# EAGLE design myPlant (EAGLE 8.2.2)
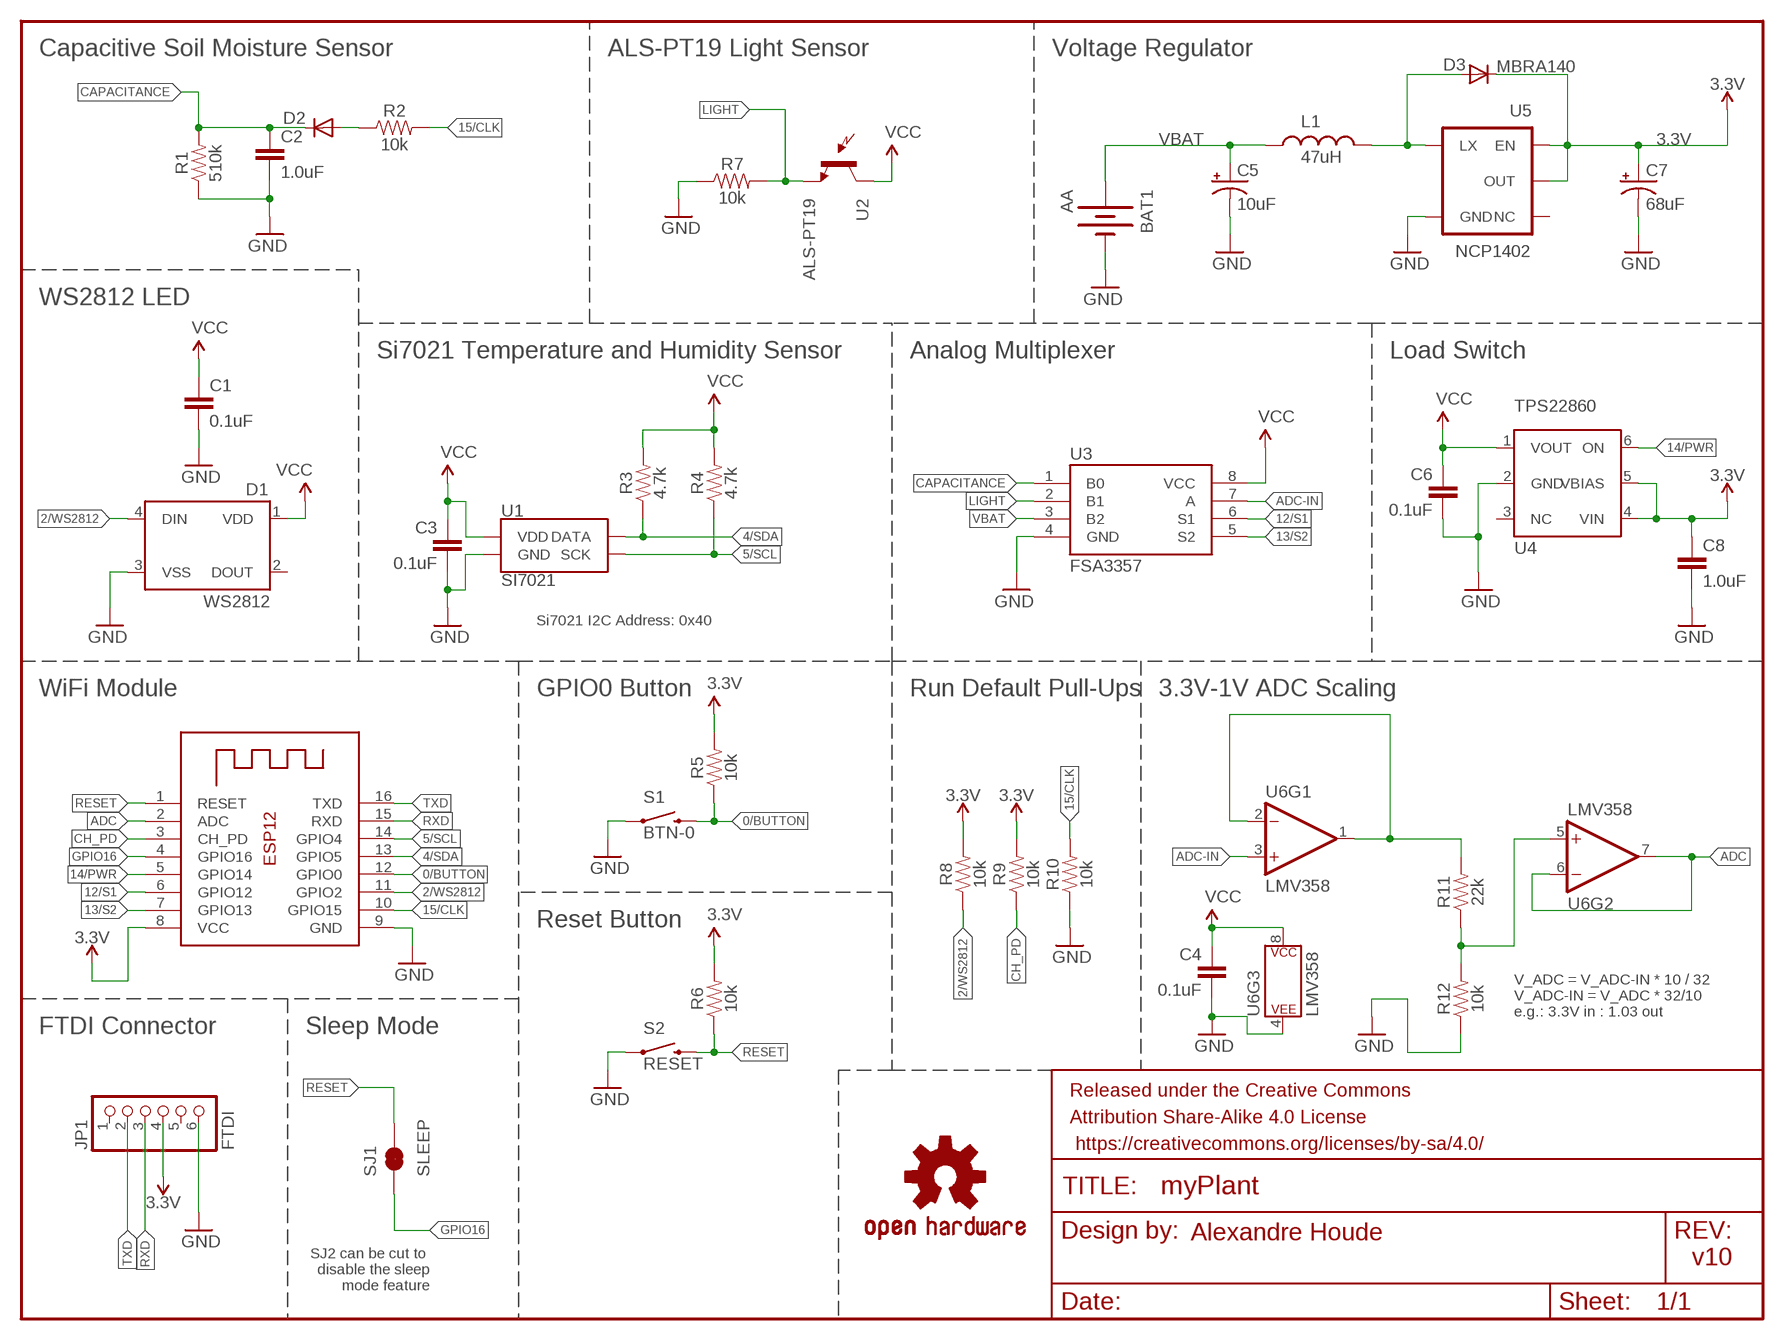
[diagram p0: schematic, sheet 1]

## Parts
BAT1  AA  BATTERYAA-KIT  [BATTERY-AA-KIT]
C1  0.1uF  0.1UF-0603-25V-(+80/-20%)  [0603]
C2  1.0uF  1.0UF-0603-16V-10%  [0603]
C3  0.1uF  0.1UF-0603-25V-(+80/-20%)  [0603]
C4  0.1uF  0.1UF-0603-25V-(+80/-20%)  [0603]
C5  10uF  CAP_POL1206  [EIA3216]
C6  0.1uF  0.1UF-0603-25V-(+80/-20%)  [0603]
C7  68uF  CAP_POL3528  [EIA3528]
C8  1.0uF  1.0UF-0603-16V-10%  [0603]
D1  WS2812  WS2812B  [WS2812B]
D2  DIODE-SCHOTTKY_  DIODESOD-523  [SOD-523]
D3  MBRA140  DIODESMA  [SMA-DIODE]
FRAME1  FRAME-LETTER  [CREATIVE_COMMONS]
JP1  FTDI  HEADER-1X670MIL  [1X06_ROUND_70]
L1  47uH  INDUCTORCR54  [CR54]
LOGO2  OSHW-LOGOS  [OSHW-LOGO-S]
R1  510k  10KOHM-0603-1/10W-1%  [0603]
R2  10k  10KOHM-0603-1/10W-1%  [0603]
R3  4.7k  4.7KOHM-0603-1/10W-1%  [0603]
R4  4.7k  4.7KOHM-0603-1/10W-1%  [0603]
R5  10k  10KOHM-0603-1/10W-1%  [0603]
R6  10k  10KOHM-0603-1/10W-1%  [0603]
R7  10k  10KOHM-0603-1/10W-1%  [0603]
R8  10k  10KOHM-0603-1/10W-1%  [0603]
R9  10k  10KOHM-0603-1/10W-1%  [0603]
R10  10k  10KOHM-0603-1/10W-1%  [0603]
R11  22k  22KOHM-0603-1/10W-1%  [0603]
R12  10k  10KOHM-0603-1/10W-1%  [0603]
S1  BTN-0  SWITCH-MOMENTARY-2SMD-4.6X2.8MM  [TACTILE_SWITCH_SMD_4.6X2.8MM]
S2  RESET  SWITCH-MOMENTARY-2SMD-4.6X2.8MM  [TACTILE_SWITCH_SMD_4.6X2.8MM]
SJ1  SLEEP  JUMPER-PAD-2-NC_BY_TRACE  [PAD-JUMPER-2-NC_BY_TRACE_YES_SILK]
U1  SI7021  [DFN-6-3X3-SI7021]
U2  ALS-PT19  LIGHTSENSORALS  [ALS-PT19]
U3  FSA3357  [US8]
U4  TPS22860  [SOT23-6]
U5  NCP1402  V_REG_NCP1400SOT23-5  [SOT23-5]
U6  LMV358  [MSOP8]
X1  ESP-12  [ESP-12]

## Nets
0/BUTTON: R5.1 S1.3 S1.4 X1.12(GPIO0)
2/WS2812: D1.4(DIN) R8.1 X1.11(GPIO2)
3.3V: C7.A(+) C8.1 D3.C JP1.4 R5.2 R6.2 R8.2 R9.2 U4.4(VIN) U4.5(VBIAS) U5.1(EN) U5.2(OUT) X1.8(VCC)
4/SDA: R3.1 U1.DATA X1.13(GPIO5)
5/SCL: R4.1 U1.SCK X1.14(GPIO4)
12/S1: U3.6(S1) X1.6(GPIO12)
13/S2: U3.5(S2) X1.7(GPIO13)
14/PWR: U4.6(ON) X1.5(GPIO14)
15/CLK: R2.2 R10.2 X1.10(GPIO15)
ADC: U6.6(-IN) U6.7(OUT) X1.2(ADC)
ADC-IN: U3.7(A) U6.3(+IN)
CAPACITANCE: C2.1 D2.K(C) R1.2 U3.1(B0)
CH_PD: R9.1 X1.3(CH_PD)
GND: BAT1.GND@1(-) C1.2 C2.2 C3.2 C4.2 C5.C(-) C6.2 C7.C(-) C8.2 D1.3(VSS) JP1.6 R1.1 R7.1 R10.1 R12.1 S1.1 S1.2 S2.1 S2.2 U1.GND U3.4(GND) U4.2(GND) U5.4(GND) U6.4(P$V-) X1.9(GND)
GPIO16: SJ1.1 X1.4(GPIO16)
LIGHT: R7.2 U2.E(E1) U3.2(B1)
N$3: D3.A L1.P$2 U5.5(LX)
N$15: R11.2 U6.1(OUT) U6.2(-IN)
N$18: R11.1 R12.2 U6.5(+IN)
RESET: R6.1 S2.3 S2.4 SJ1.2 X1.1(RESET)
RXD: JP1.3 X1.15(RXD)
TXD: JP1.2 X1.16(TXD)
V_CAP: D2.A R2.1
VBAT: BAT1.PWR@1(+) C5.A(+) L1.P$1 U3.3(B2)
VCC: C1.1 C3.1 C4.1 C6.1 D1.1(VDD) R3.2 R4.2 U1.VDD U2.C(C1) U3.8(VCC) U4.1(VOUT) U6.8(P$V+)
Unconnected: D1.2(DOUT) JP1.1 JP1.5 U4.3(NC) U5.3(NC)

## Notes on the sheet
- Capacitive Soil Moisture Sensor | ALS-PT19 Light Sensor | Voltage Regulator
- WS2812 LED
- Si7021 Temperature and Humidity Sensor | Analog Multiplexer | Load Switch
- Si7021 I2C Address: 0x40
- WiFi Module | GPIO0 Button | Run Default Pull-Ups | 3.3V-1V ADC Scaling
- Reset Button
- V_ADC = V_ADC-IN * 10 / 32
  V_ADC-IN = V_ADC * 32/10
  e.g.: 3.3V in : 1.03 out
- FTDI Connector | Sleep Mode
- Alexandre Houde
- SJ2 can be cut to 
  disable the sleep
  mode feature
- v10

## Library data of the parts
BAT1 = SparkFun:BATTERY: Battery Holders Various common sizes : AA, AAA, 20mm coin cell and 12mm coin cell.
C1 C3 C4 C6 = SparkFun-Capacitors:0.1UF: 0.1µF ceramic capacitors A capacitor is a passive two-terminal electrical component used to store electrical energy temporarily in an electric field.; PROD_ID: CAP-00810
C2 C8 = SparkFun-Capacitors:1.0UF: 1µF ceramic capacitors A capacitor is a passive two-terminal electrical component used to store electrical energy temporarily in an electric field.; PROD_ID: CAP-00868
C5 C7 = SparkFun:CAP_POL: Capacitor Polarized These are standard SMD and PTH capacitors. Normally 10uF, 47uF, and 100uF in electrolytic and tantalum varieties. Always verify the external diameter of the through hole cap, it varies with capacity, voltage, and manufacturer. The EIA devices should be standard.
D1 = SparkFun-LED:WS2812B: WS2812B - Intelligent control LED integrated light source Technical Specifications: Power Supply Voltage (VDD): 3.5 to 5.3 V Input Voltage (VI): -0.5 to VDD+0.5 V Operating Junction Temperature (Topt): -25°C to +80°C Storage Temperature Range (Tstg): -55°C to +150°C; PROD_ID: DIO-12503
D2 = microbuilder:DIODE: Diode
D3 = SparkFun:DIODE: Diode
FRAME1 = SparkFun-Aesthetics:FRAME-LETTER: Schematic Frame - Letter Standard 8.5x11 US Letter frame
JP1 = microbuilder:HEADER-1X6: PIN HEADER
L1 = SparkFun:INDUCTOR: Inductors Basic Inductor/Choke - 0603 and 1206. Footprints are not proven and vary greatly between part numbers.
LOGO2 = SparkFun-Aesthetics:OSHW-LOGO: Open Source Hardware Logo This logo indicates the piece of hardware it is found on incorporates a OSHW license and/or adheres to the definition of open source hardware found here: http://freedomdefined.org/OSHW
R1 = SparkFun-Resistors:10KOHM: 10kΩ resistor A resistor is a passive two-terminal electrical component that implements electrical resistance as a circuit element. Resistors act to reduce current flow, and, at the same time, act to lower voltage levels within circuits. - Wikipedia; PROD_ID: RES-00824; VALUE: 10k
R2 R5-R10 R12 = SparkFun-Resistors:10KOHM: 10kΩ resistor A resistor is a passive two-terminal electrical component that implements electrical resistance as a circuit element. Resistors act to reduce current flow, and, at the same time, act to lower voltage levels within circuits. - Wikipedia; PROD_ID: RES-00824
R3 R4 = SparkFun-Resistors:4.7KOHM: 4.7kΩ resistor A resistor is a passive two-terminal electrical component that implements electrical resistance as a circuit element. Resistors act to reduce current flow, and, at the same time, act to lower voltage levels within circuits. - Wikipedia; PROD_ID: RES-07857
R11 = SparkFun-Resistors:22KOHM: 22kΩ resistor A resistor is a passive two-terminal electrical component that implements electrical resistance as a circuit element. Resistors act to reduce current flow, and, at the same time, act to lower voltage levels within circuits. - Wikipedia; PROD_ID: RES-07853
S1 S2 = SparkFun-Electromechanical:SWITCH-MOMENTARY-2: Various NO switches- pushbuttons, reed, etc; PROD_ID: SWCH-13065
SJ1 = SparkFun-Passives:JUMPER-PAD-2-NC_BY_TRACE
U1 = SparkFun-Sensors:SI7021: Silicon Labs Si7021 I2C Humidity and Temperature Sensor The Si7021 is a low-cost, easy-to-use, highly accurate, digital humidity and temperature sensor. This sensor is ideal for environmental sensing and data logging and perfect for build a weather stations or humidor control system. All you need are two lines for I2C communication, and you’ll have relative humidity readings and very accurate temperature readings as a bonus! Datasheet <https://cdn.sparkfun.com/datasheets/Sensors/Weather/Si7021.pdf> SparkFun Products SparkFun Humidity and Temperature Sensor Breakout - Si7021 <https://www.sparkfun.com/products/13763> (SEN-13763) SparkFun Blynk Board - ESP8266 <https://www.sparkfun.com/products/13794> (WRL-13794); PROD_ID: IC-13093
U2 = SparkFun-Sensors:LIGHTSENSOR: Ambient Light Sensor Simple light detection sensor. Output varies with light intensity input. Spark Fun Electronics SKU : COM-08348; PROD_ID: IC-11836
U3 = alex:FSA3357
U4 = alex:TPS22860
U5 = SparkFun:V_REG_NCP1400: Switching step-up voltage regulator NCP1400 switiching regulator takes single cell AA and outputs 100mA at 3.3V or 5V with minimal number of external components.
U6 = SparkFun-IC-Amplifiers:LMV358: IC LMV358 DUAL OP AMP Jellybean rail-to-rail output op-amp SparkFun Products SparkFun PicoBoard <https://www.sparkfun.com/products/11888> (WIG-11888) SparkFun Vernier Interface Shield <https://www.sparkfun.com/products/12858> (DEV-12858) SparkFun Blynk Board - ESP8266 <https://www.sparkfun.com/products/13794> (WRL-13794) SparkFun Digital Sandbox <https://www.sparkfun.com/products/12651> (DEV-12651 RoHS)
X1 = microbuilder:ESP-12

## Net classes
1 vcc: width 0.203 mm

## Board
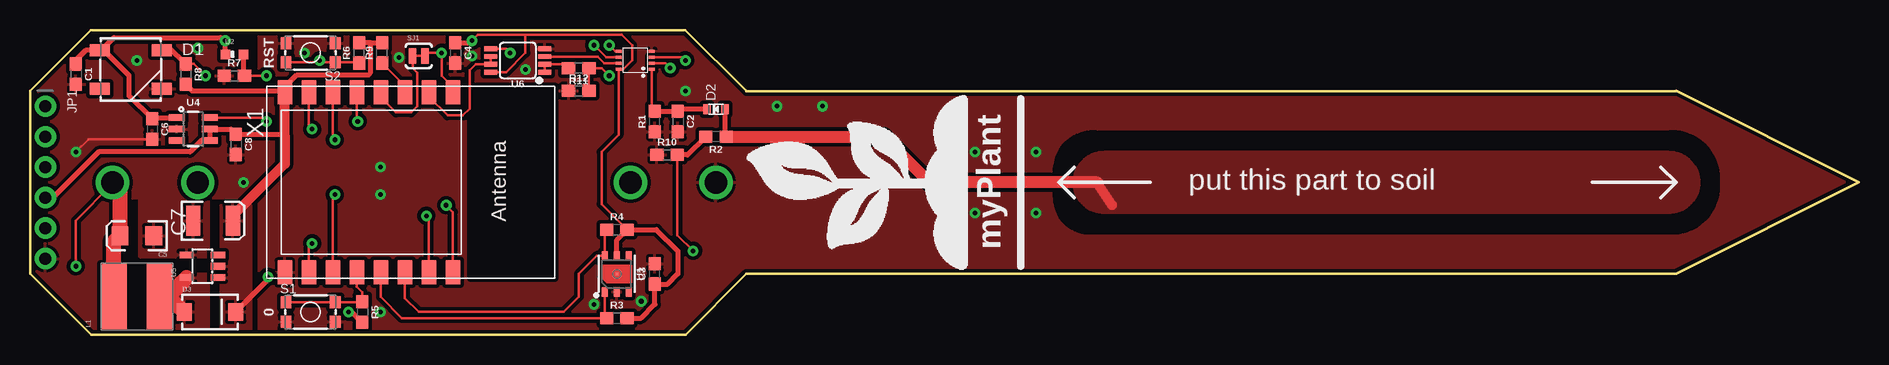
[diagram p1: board, top side]
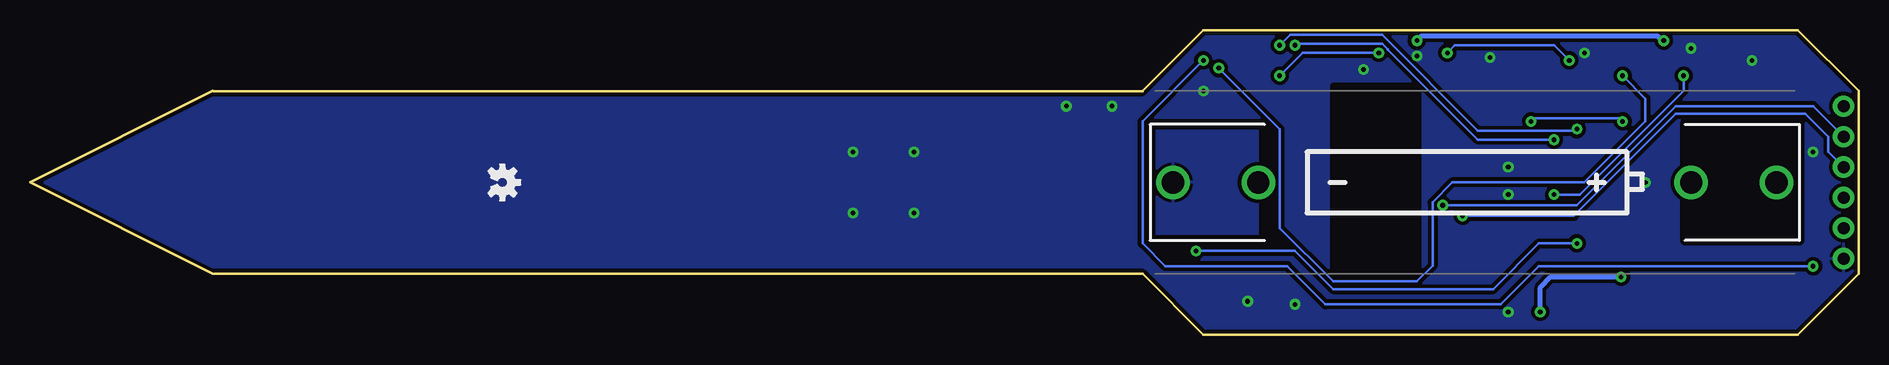
[diagram p2: board, bottom side, seen from below]

Size 152.41 x 25.4 mm. Coordinates in mm from the lower left corner, seen from the top.
Outline: 137.17,20.31 59.7,20.31
Outline: 5.1,25.4 54.62,25.4 59.7,20.33
Outline: 5.1,0 54.63,0 59.7,5.08 137.17,5.08 152.4,12.7
Outline: 152.41,12.71 137.17,20.32
Outline: 5.09,0.01 0.01,5.08 0,20.32
Outline: 5.08,25.4 0.01,20.32
Copper layers (1*16): Top 0.035mm / dielectric 1.5mm / Bottom 0.035mm
Design rules "SparkFun *": minimum track width 8mil, minimum drill 10mil, track to track 8mil, track to pad 8mil, pad to pad 8mil, via to via 8mil, smd to smd 8mil, copper to edge 8mil, drill to drill 8mil, minimum pad ring 12mil, minimum via ring 10mil, stop-mask expansion 4mil, vias tented up to drill 20mil, thermal gap 10mil

### Footprints (pad centres in the part's own frame; a part is rotated, then mirrored left to right if it is on the bottom)
BATTERY-AA-KIT = drill 1.854: GND@1 25.146,0; GND@2 18.034,0; PWR@1 -25.146,0; PWR@2 -18.034,0
0603 = smd 1.1 x 1: 1 -0.85,0; 2 0.85,0
EIA3216 = smd 1.4 x 1.6: A 1.4,0; C -1.4,0
EIA3528 = smd 1.2 x 2.5: A 1.65,0; C -1.65,0
WS2812B = smd 1.651 x 1: 1 -2.577,1.6; 2 -2.577,-1.6; 3 2.577,-1.6; 4 2.577,1.6
SOD-523 = smd 0.8 x 0.6: A 0,-0.75; K 0,0.75
SMA-DIODE = smd 1.27 x 1.47: A -2.15,0; C 2.15,0
1X06_ROUND_70 = drill 1 pad 1.778: 1 -6.35,0; 2 -3.81,0; 3 -1.27,0; 4 1.27,0; 5 3.81,0; 6 6.35,0
CR54 = smd 5.5 x 2.15: P$1 0,1.92; P$2 0,-1.92
TACTILE_SWITCH_SMD_4.6X2.8MM = smd 0.9 x 1: 1 -2.05,-0.8; 2 2.05,-0.8; 3 2.05,0.8; 4 -2.05,0.8
PAD-JUMPER-2-NC_BY_TRACE_YES_SILK = smd 0.635 x 1.27: 1 -0.508,0; 2 0.508,0
DFN-6-3X3-SI7021 = smd 0.2 x 0.2: 7 0,0 | smd 0.8 x 0.5: DATA 1.5,-1; GND 1.5,0; NC@3 1.5,1; NC@4 -1.5,1; SCK -1.5,-1; VDD -1.5,0
ALS-PT19 = smd 0.8 x 0.8: C -0.75,0; E 0.75,0
US8 = smd 0.25 x 0.5: 1 -0.73,-1.37; 2 -0.23,-1.37; 3 0.27,-1.37; 4 0.77,-1.37; 5 0.77,1.38; 6 0.27,1.38; 7 -0.23,1.38; 8 -0.73,1.38
SOT23-6 = smd 0.55 x 1.35: 1 -0.95,-1.375; 2 0,-1.375; 3 0.95,-1.375; 4 0.95,1.375; 5 0,1.375; 6 -0.95,1.375
SOT23-5 = smd 0.55 x 1.2: 1 -0.95,-1.3; 2 0,-1.3; 3 0.95,-1.3; 4 0.95,1.3; 5 -0.95,1.3
MSOP8 = smd 0.4 x 1.1: 1 -0.975,-2.25; 2 -0.325,-2.25; 3 0.325,-2.25; 4 0.975,-2.25; 5 0.975,2.25; 6 0.325,2.25; 7 -0.325,2.25; 8 -0.975,2.25
ESP-12 = smd 2 x 1.2: 1 -7.5,4.5; 2 -7.5,2.5; 3 -7.5,0.5; 4 -7.5,-1.5; 5 -7.5,-3.5; 6 -7.5,-5.5; 7 -7.5,-7.5; 8 -7.5,-9.5; 9 7.5,-9.5; 10 7.5,-7.5; 11 7.5,-5.5; 12 7.5,-3.5; 13 7.5,-1.5; 14 7.5,0.5; 15 7.5,2.5; 16 7.5,4.5

### Placement (x,y rotation side)
BAT1  32.01,12.7 180 bottom
C1  3.82,21.72 270 top
C2  53.98,17.78 270 top
C3  52.08,5.08 90 top
C4  35.44,23.5 270 top
C5  8.9,8.26 180 top
C6  10.17,17.14 270 top
C7  15.25,9.53 0 top
C8  17.16,15.88 270 top
D1  8.39,22.1 0 top
D2  57.16,18.8 90 top
D3  15,1.91 0 top
FRAME1  20.84,-9.14 0 top  (outside the outline)
JP1  1.28,12.7 270 top
L1  8.9,3.17 90 top
LOGO2  113.04,12.7 270 bottom
R1  52.08,17.78 90 top
R2  57.16,16.51 180 top
R3  48.91,1.4 0 top
R4  48.91,8.76 0 top
R5  27.7,1.91 270 top
R6  27.44,23.5 90 top
R7  17.03,21.59 0 top
R8  12.96,21.72 270 top
R9  29.35,23.5 90 top
R10  53.1,14.99 0 top
R11  45.73,22.23 180 top
R12  45.73,20.32 0 top
S1  23.38,1.91 0 top
S2  23.38,23.5 180 top
SJ1  32.39,23.24 0 top
U1  48.91,5.08 270 top
U2  17.03,23.37 0 top
U3  50.43,22.86 90 top
U4  13.6,17.14 270 top
U5  14.36,5.71 90 top
U6  40.65,22.86 90 top
X1  30.74,12.7 270 top

### Tracks (layer width: path | path; a pad name or v marks a point on that pad's centre or on a via)
0/BUTTON
  Top 0.203: S1.4 S1.3 27.39,2.71 R5.1 27.7,3.56 27.24,4.01 X1.12
2/WS2812  (via drill 0.38)
  Top 0.203: R8.1 13.64,22.57 v14.62,21.59 | X1.11 25.24,11.28 v25.4,11.69
  Top 0.406: D1.4 11.58,23.95 R8.1
  Bottom 0.203: v14.62,21.59 14.62,20.33 23.26,11.69 v25.4,11.69
3.3V  (via drill 0.38)
  Top 0.406: JP1.4 1.92,11.43 5.72,15.24 13.35,15.24 14.3,16.2 U4.4 U4.5 16.74,17.14 C8.1 21.03,16.73 21.24,16.51 | X1.8 21.12,20.32 13.51,20.32 R8.2 | v19.82,4.83 19.82,4.58 D3.C | X1.8 21.24,20.6 | 28.39,24.34 R6.2 | 28.39,24.34 R9.2 | 28.39,24.34 28.39,21.84 28.2,21.65 22.24,21.65 21.24,20.66 X1.8 | v26.55,1.91 26.81,1.91 27.66,1.05 R5.2
  Top 0.813: X1.8 21.24,16.51 21.24,14.25 16.9,9.9 C7.A
  Bottom 0.406: v19.82,4.83 25.66,4.83 26.55,3.94 v26.55,1.91
  pour Top (isolate 0.305): 18.43,0 18.43,10.79 15.88,10.79 15.88,0
4/SDA
  Top 0.203: X1.13 29.24,3.15 31,1.4 R3.1 47.91,1.55 U1.DATA
5/SCL
  Top 0.203: R4.1 47.91,8.61 U1.SCK 47.23,6.58 45.73,5.08 45.73,3.17 44.46,1.91 32.39,1.91 31.24,3.06 X1.14
12/S1  (via drill 0.38)
  Top 0.203: U3.6 48,23.13 v47,24.13 | X1.6 25.24,16.68 v25.41,16.26
  Bottom 0.203: v25.41,16.26 31.76,16.26 39.27,23.76 39.27,23.8 39.7,24.24 46.89,24.24 v47,24.13
13/S2  (via drill 0.38)
  Top 0.203: U3.5 48.77,23.63 v48.27,24.13 | X1.7 23.24,17.41 v23.51,17.14
  Bottom 0.203: v23.51,17.14 23.63,17.02 31.76,17.02 39.74,24.99 47.41,24.99 v48.27,24.13
14/PWR  (via drill 0.38)
  Top 0.203: X1.5 27.24,17.85 v27.32,17.78 | v19.7,17.78 19.38,18.09 U4.6
  Bottom 0.203: v19.7,17.78 19.82,17.78 20.08,18.03 27.06,18.03 v27.32,17.78
15/CLK  (via drill 0.38)
  Top 0.203: v55.25,6.99 53.95,8.29 R10.2 | X1.10 23.24,7.36 v23.51,7.62
  Top 0.406: R10.2 54.79,14.99 R2.2
  Bottom 0.203: v55.25,6.99 47,6.99 43.82,3.81 30.49,3.81 26.68,7.62 v23.51,7.62
ADC
  Top 0.203: U6.6 U6.7 37.15,22.54 36.64,22.03 36.64,18.85 36.08,18.29 34.81,18.29 33.24,19.85 X1.2
ADC-IN
  Top 0.203: U3.7 47.86,22.63 47.31,23.18 U6.3
CAPACITANCE
  Top 0.203: U3.1 51.8,18.91 R1.2
  Top 0.406: R1.2 C2.1 54.15,18.8 D2.K
CH_PD
  Top 0.203: X1.3 31.24,20.75 R9.1
GND  (via drill 0.38)
  Top 0.203: C6.2 4.88,16.3 v3.82,15.24
  Top 0.406: D1.3 11.01,20.75
  other vias: 8.9,22.86 13.98,23.88 50.94,2.79 29.22,1.91 66.05,19.05 78.75,15.24 83.83,15.24 78.75,10.16 83.83,10.16 62.24,19.05 17.79,12.7 41.28,22.1 29.22,13.97 36.84,23.24 22.87,23.5 30.74,23.11 54.62,20.32 29.22,11.68 47,2.54
  pour Top (isolate 0.305): 19.06,25.39 19.06,0 85.1,0 85.1,25.39
  pour Bottom (isolate 0.305): 55.89,20.31 136.84,20.31 152.41,12.7 137.17,5.08 55.89,5.08
  pour Top (isolate 0.305, no thermals): 85.1,20.31 136.84,20.31 152.41,12.7 137.17,5.08 85.1,5.08 85.1,11.43 arc90 88.28,8.26 136.53,8.26 arc90 140.98,12.06 140.98,13.34 arc90 136.53,17.14 88.91,17.14 arc90 85.1,13.97
  pour Top (isolate 0.305): 14.87,14.61 14.87,6.48 9.15,6.48 9.15,14.61
  pour Top (isolate 0.305): 0.01,11.43 20.33,11.43 20.33,25.4 0.01,25.4
  pour Top (isolate 0.305): 0.01,0 8.27,0 8.27,12.7 0.01,12.7
  pour Bottom (isolate 0.305): 82.56,0 0.01,0 0.01,25.4 82.56,25.4
GPIO16
  Top 0.203: SJ1.1 31.89,22.23 32.27,21.84 32.27,19.05 31.76,18.54 30.49,18.54 29.47,19.56 29.47,19.97 X1.4
LIGHT  (via drill 0.38)
  Top 0.203: R7.2 v19.7,21.59 | U3.2 52.95,22.63 v53.35,22.23
  Top 0.406: U2.E 17.78,21.69 R7.2
  Bottom 0.203: v19.7,21.59 17.79,19.68 17.79,17.78 22.87,12.7 33.87,12.7 35.53,11.04 35.53,5.75 36.84,4.45 43.82,4.45 48.27,8.89 48.27,17.14 v53.35,22.23
N$3
  Top 1.27: D3.A 11.58,3.17 L1.P$2 11.47,3.17 U5.5
  pour Top (isolate 0.305): 14.87,5.08 14.87,0 10.17,0 10.17,5.08
N$15
  Top 0.203: R11.2 44.57,22.54 U6.2 U6.1
N$18  (via drill 0.38)
  Top 0.203: R12.2 R11.1 47.63,22.23 v48.27,21.59 | U6.5 39.67,23.84 v40.02,23.5
  Bottom 0.203: v48.27,21.59 46.36,23.5 v40.02,23.5
RESET  (via drill 0.38)
  Top 0.203: R6.1 27.39,22.7 S2.4 24.14,22.7 | X1.1 35.24,20.65 34.3,21.59 v34.3,23.5 33.16,23.5 SJ1.2 | 24.14,22.7 S2.3 | v24.14,22.86 24.14,22.7
  Bottom 0.203: v34.3,23.5 33.66,24.13 25.41,24.13 v24.14,22.86
RXD  (via drill 0.38)
  Top 0.203: X1.15 33.24,9.69 v33.03,9.91
  Bottom 0.203: JP1.3 2.55,15.24 2.55,16.51 4.46,18.41 15.25,18.41 23.76,9.91 v33.03,9.91
TXD  (via drill 0.38)
  Top 0.203: X1.16 35.24,10.23 v34.68,10.79
  Bottom 0.203: JP1.2 3.82,19.05 15.25,19.05 23.51,10.79 v34.68,10.79
V_CAP
  Top 0.406: D2.A 57.91,16.61 R2.1
  Top 0.813: 90.16,10.82 88.91,12.7
  Top 1.016: 88.91,12.7 74.94,12.7 71.13,16.51 R2.1
  pour Top (no thermals): 87.01,12.7 arc-90 89.55,15.24 136.53,15.24 arc-90 139.07,12.7 arc-90 136.53,10.16 89.55,10.16 arc-90
VBAT  (via drill 0.38)
  Top 0.203: BAT1.PWR@1 6.87,12.57 3.82,9.53 v3.82,5.71 | U3.3 54.35,23.13 v54.62,22.86
  Top 1.27: L1.P$1 6.98,7.74 C5.A 7.5,12.07 BAT1.PWR@1
  Top 1.524: 7,3.19 L1.P$1
  Bottom 0.203: v54.62,22.86 59.7,17.78 59.7,7.62 57.79,5.71 47.63,5.71 44.46,2.54 29.86,2.54 26.68,5.71 v3.82,5.71
VCC  (via drill 0.38)
  Top 0.203: U6.8 39.67,21.89 41.28,23.5 41.28,24.99 | R4.2 47.63,10.88 47.63,15.24 49.05,16.65 U3.8 49.45,22.13 50.17,22.86 50.17,24.13 49.31,24.99 41.28,24.99 | 37.09,24.77 v36.84,24.51 37.32,24.99 41.28,24.99
  Top 0.406: U4.1 10.27,18.09 C6.1 8.27,19.9 8.27,21.59 6.16,23.7 5.93,23.7 | 16.28,23.74 U2.C 16.28,24.5 v16.27,24.51 16.14,24.51 15.88,24.77 7,24.77 5.93,23.7 | R3.2 50.94,1.4 52.08,2.54 C3.1 53.13,4.23 53.98,5.08 53.98,6.99 52.21,8.76 R4.2 48.91,7.91 U1.VDD | 5.93,23.7 D1.1 4.66,23.7 3.82,22.86 C1.1 | C4.1 36.67,24.34 v36.84,24.51
  Bottom 0.406: v16.27,24.51 16.39,24.51 16.77,24.89 36.46,24.89 v36.84,24.51

### Text on the board
tPlace: RST | 0
tNames: put this part to soil | myPlant
tDocu: Alexandre Houde